# EAGLE schematic BEP32_Test_Interface5 (EAGLE 6.5.0)
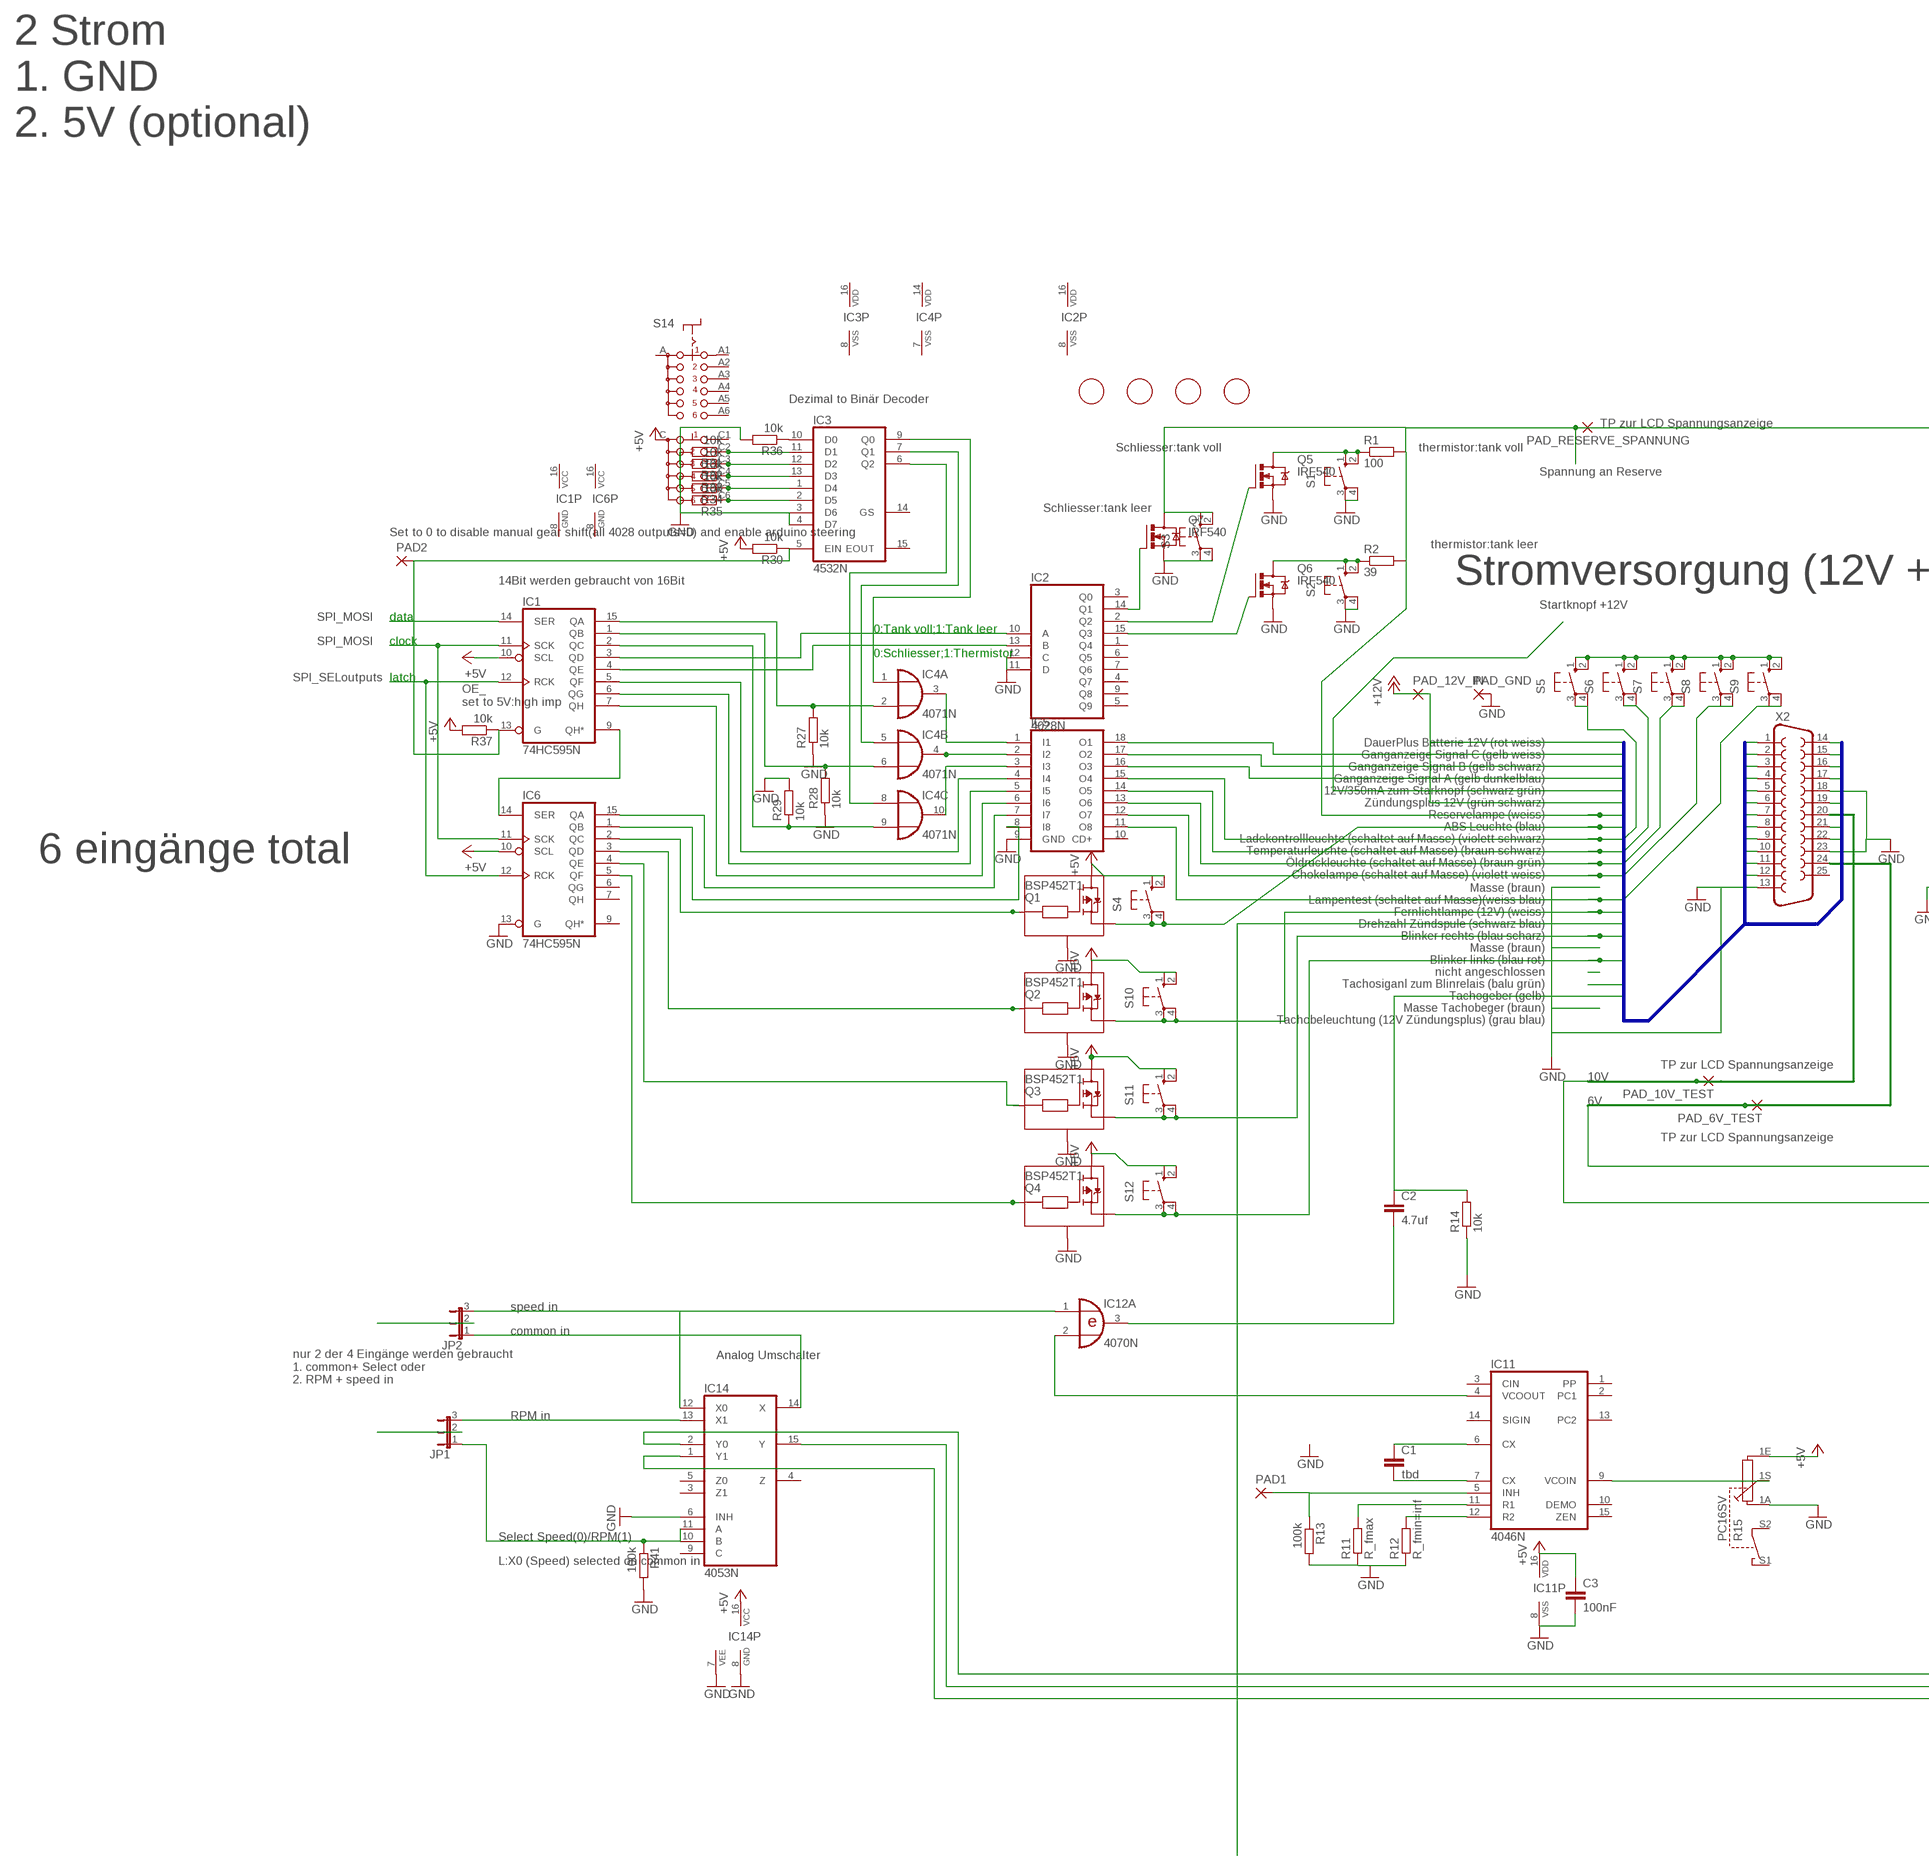
[diagram p0: schematic, sheet 1, part 1 of 2]
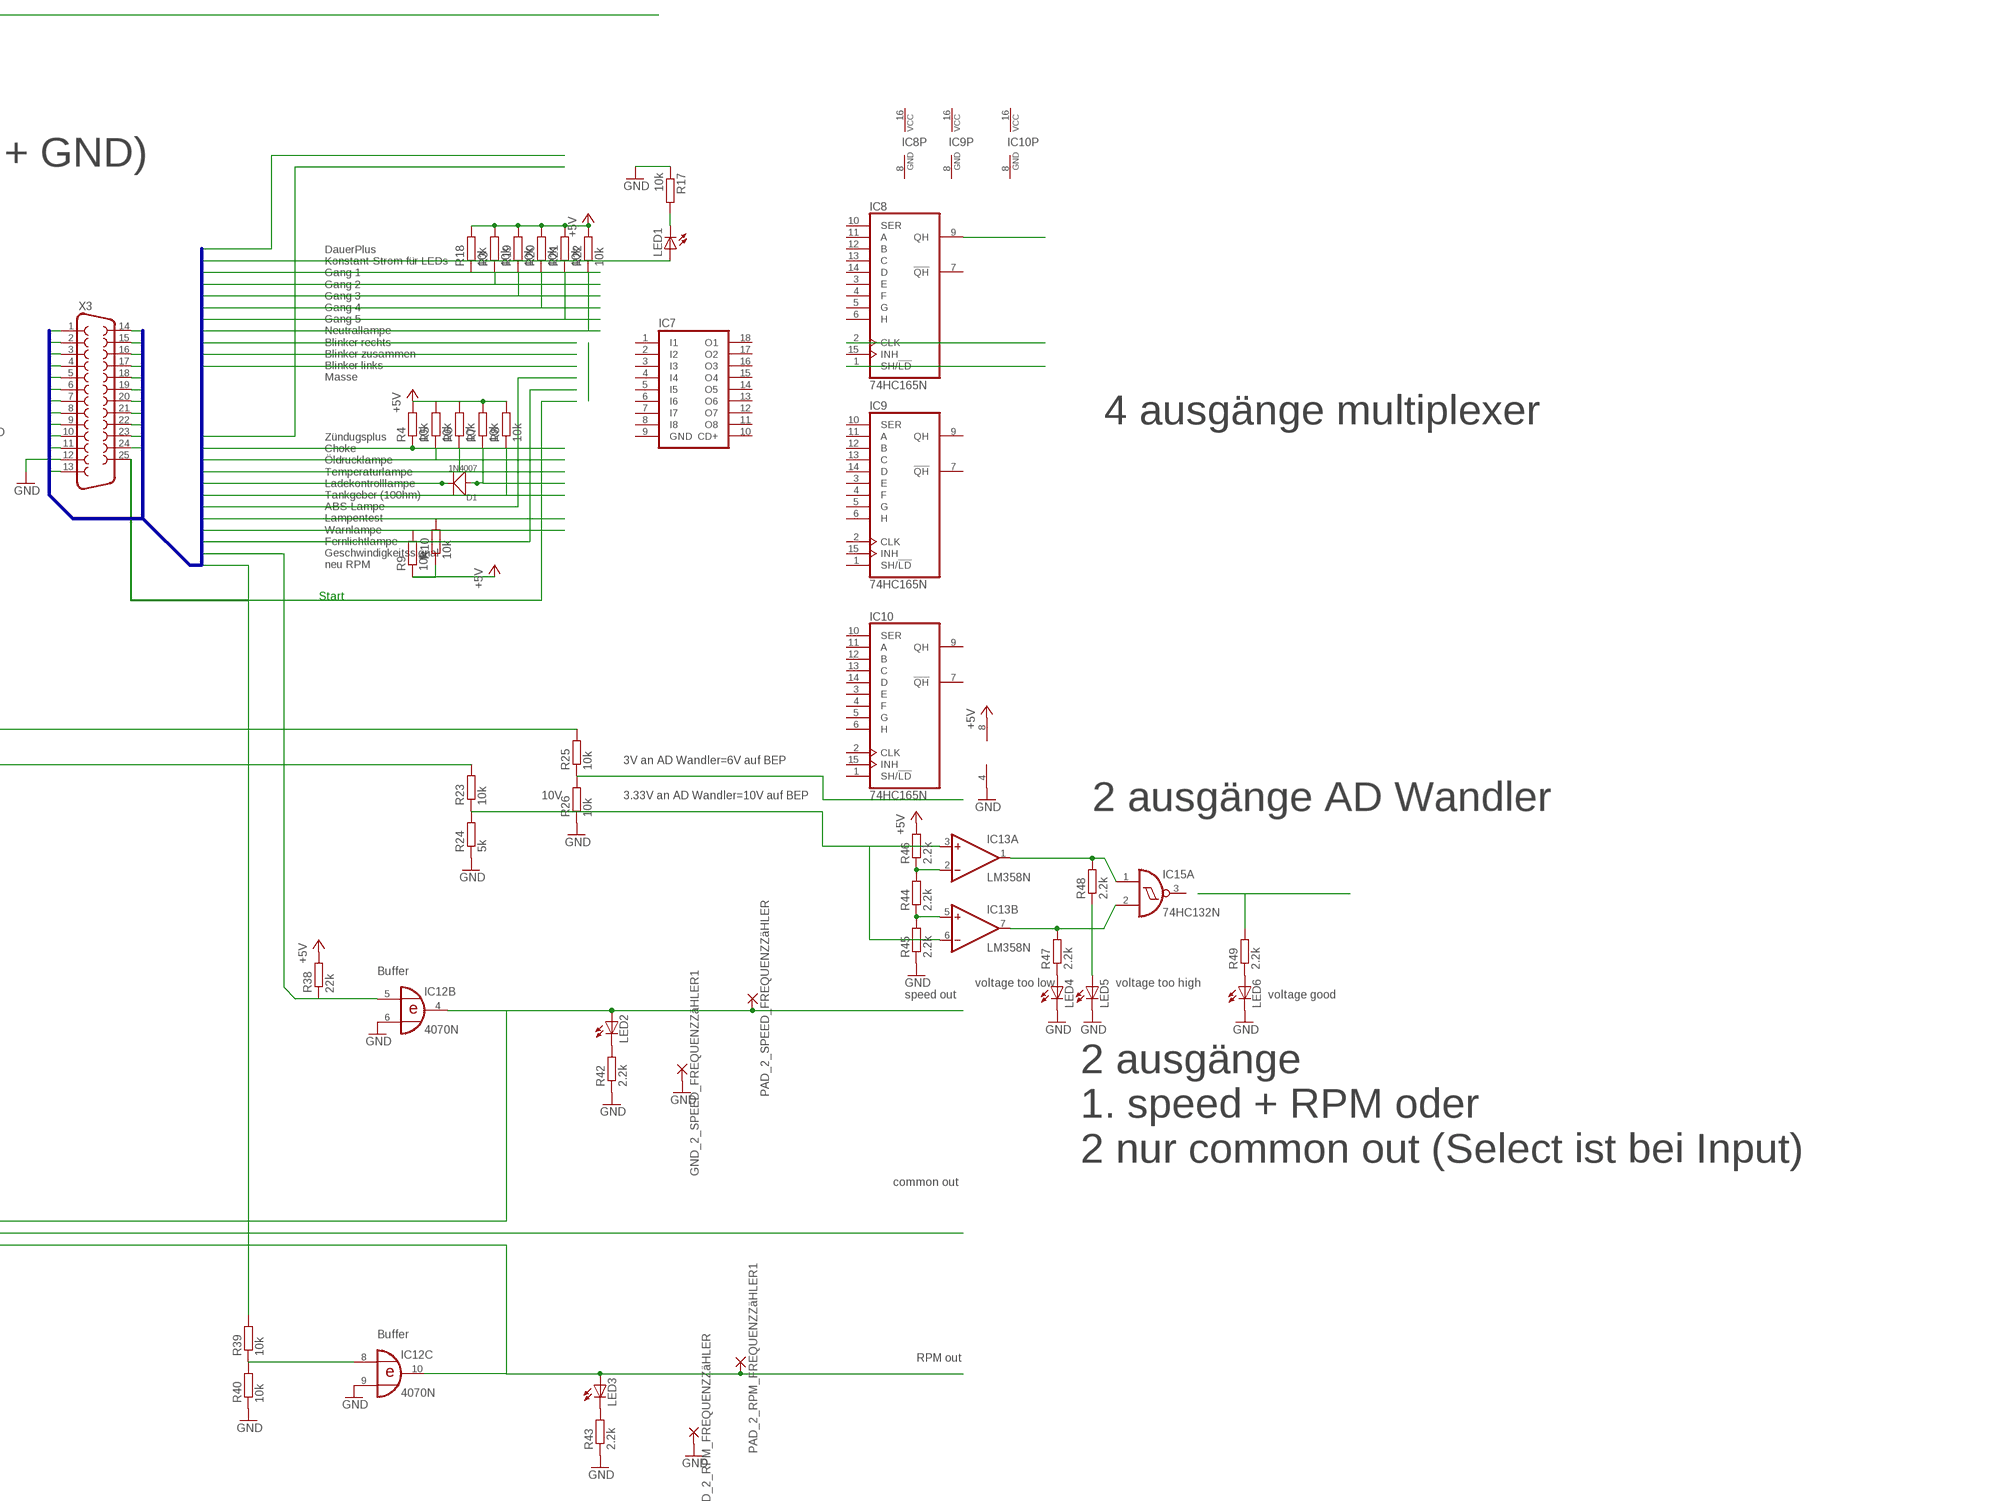
[diagram p1: schematic, sheet 1, part 2 of 2]

## Parts
C1  tbd  C-EUC1206K  [C1206K]
C2  4.7uf  C-EU025_050-025X075  [C025_050-025X075]
C3  100nF  C-EUC1206K  [C1206K]
D1  1N4007  DIODE-GEN-PURPOSE-1KV-1A(DO-214AC)  [DO-214AC]
GND_2_RPM_FREQUENZZäHLER  1,6/0,9  [1,6/0,9]
GND_2_SPEED_FREQUENZZäHLER1  1,6/0,9  [1,6/0,9]
IC1  74HC595N  [DIL16]
IC2  4028N  [DIL16]
IC3  4532N  [DIL16]
IC4  4071N  [DIL14]
IC5  ULN2803A  [DIL18]
IC6  74HC595N  [DIL16]
IC7  ULN2803A  [DIL18]
IC8  74HC165N  [DIL16]
IC9  74HC165N  [DIL16]
IC10  74HC165N  [DIL16]
IC11  4046N  [DIL16]
IC12  4070N  [DIL14]
IC13  LM358N  [DIL08]
IC14  4053N  [DIL16]
IC15  74HC132N  [DIL14]
JP1  JP2E  [JP2]
JP2  JP2E  [JP2]
LED1  LED5MM  [LED5MM]
LED2  LED5MM  [LED5MM]
LED3  LED5MM  [LED5MM]
LED4  LED5MM  [LED5MM]
LED5  LED5MM  [LED5MM]
LED6  LED5MM  [LED5MM]
PAD1  1,6/0,9  [1,6/0,9]
PAD2  1,6/0,9  [1,6/0,9]
PAD_2_RPM_FREQUENZZäHLER1  1,6/0,9  [1,6/0,9]
PAD_2_SPEED_FREQUENZZäHLER  1,6/0,9  [1,6/0,9]
PAD_6V_TEST  1,6/0,9  [1,6/0,9]
PAD_10V_TEST  1,6/0,9  [1,6/0,9]
PAD_12V_IN  1,6/0,9  [1,6/0,9]
PAD_GND  1,6/0,9  [1,6/0,9]
PAD_RESERVE_SPANNUNG  1,6/0,9  [1,6/0,9]
Q1  BSP452T1  [SOT223]
Q2  BSP452T1  [SOT223]
Q3  BSP452T1  [SOT223]
Q4  BSP452T1  [SOT223]
Q5  IRF540  [TO220BV]
Q6  IRF540  [TO220BV]
Q7  IRF540  [TO220BV]
R1  100  R-EU_0207/10  [0207/10]
R2  39  R-EU_0207/10  [0207/10]
R3  10k  R-EU_0207/10  [0207/10]
R4  10k  R-EU_0207/10  [0207/10]
R5  10k  R-EU_0207/10  [0207/10]
R6  10k  R-EU_0207/10  [0207/10]
R7  10k  R-EU_0207/10  [0207/10]
R8  10k  R-EU_0207/10  [0207/10]
R9  10k  R-EU_0207/10  [0207/10]
R10  10k  R-EU_0207/10  [0207/10]
R11  R_fmax  R-EU_0207/10  [0207/10]
R12  R_fmin=inf  R-EU_0207/10  [0207/10]
R13  100k  R-EU_0207/10  [0207/10]
R14  10k  R-EU_0207/10  [0207/10]
R15  PC16SV  [PC16SV]
R17  10k  R-EU_0207/10  [0207/10]
R18  10k  R-EU_0207/10  [0207/10]
R19  10k  R-EU_0207/10  [0207/10]
R20  10k  R-EU_0207/10  [0207/10]
R21  10k  R-EU_0207/10  [0207/10]
R22  10k  R-EU_0207/10  [0207/10]
R23  10k  R-EU_0207/10  [0207/10]
R24  5k  R-EU_0207/10  [0207/10]
R25  10k  R-EU_0207/10  [0207/10]
R26  10k  R-EU_0207/10  [0207/10]
R27  10k  R-EU_0207/10  [0207/10]
R28  10k  R-EU_0207/10  [0207/10]
R29  10k  R-EU_0207/10  [0207/10]
R30  10k  R-EU_0207/10  [0207/10]
R31  10k  R-EU_0207/10  [0207/10]
R32  10k  R-EU_0207/10  [0207/10]
R33  10k  R-EU_0207/10  [0207/10]
R34  10k  R-EU_0207/10  [0207/10]
R35  10k  R-EU_0207/10  [0207/10]
R36  10k  R-EU_0207/10  [0207/10]
R37  10k  R-EU_0207/10  [0207/10]
R38  22k  R-EU_0207/10  [0207/10]
R39  10k  R-EU_0207/10  [0207/10]
R40  10k  R-EU_0207/10  [0207/10]
R41  100k  R-EU_0207/10  [0207/10]
R42  2.2k  R-EU_0207/10  [0207/10]
R43  2.2k  R-EU_0207/10  [0207/10]
R44  2.2k  R-EU_0207/10  [0207/10]
R45  2.2k  R-EU_0207/10  [0207/10]
R46  2.2k  R-EU_0207/10  [0207/10]
R47  2.2k  R-EU_0207/10  [0207/10]
R48  2.2k  R-EU_0207/10  [0207/10]
R49  2.2k  R-EU_0207/10  [0207/10]
S1  40-XX  [B3F-40XX]
S2  40-XX  [B3F-40XX]
S3  40-XX  [B3F-40XX]
S4  40-XX  [B3F-40XX]
S5  40-XX  [B3F-40XX]
S6  40-XX  [B3F-40XX]
S7  40-XX  [B3F-40XX]
S8  40-XX  [B3F-40XX]
S9  40-XX  [B3F-40XX]
S10  40-XX  [B3F-40XX]
S11  40-XX  [B3F-40XX]
S12  40-XX  [B3F-40XX]
S14  CK102X06  [CK102X06]
U$1  FIDUCIAL  [FIDUCIAL_1MM]
U$2  FIDUCIAL  [FIDUCIAL_1MM]
U$3  FIDUCIAL  [FIDUCIAL_1MM]
U$4  FIDUCIAL  [FIDUCIAL_1MM]
X2  F25H  [F25H]
X3  F25H  [F25H]

## Nets
+5V: C3.1 IC1.10(SCL) IC6.10(SCL) IC11.16(VDD) IC13.8(P:V+) IC14.16(VCC) Q1.4(V+) Q2.4(V+) Q3.4(V+) Q4.4(V+) R3.2 R4.2 R5.2 R6.2 R7.2 R8.2 R9.1 R10.1 R15.1E R18.2 R19.2 R20.2 R21.2 R22.2 R30.2 R37.2 R38.2 R46.2 S4.2(S1) S10.2(S1) S11.2(S1) S12.2(S1) S14.C
BMW1: PAD_12V_IN.1(P) X2.1 ; supply symbol labelled +12V
BMW2: IC5.18(O1) X2.2
BMW3: IC5.17(O2) X2.3
BMW4: IC5.16(O3) X2.4
BMW5: X2.5
BMW6: X2.6
BMW7: PAD_RESERVE_SPANNUNG.1(P) Q7.D R1.2 R2.2 S3.1(S) S3.2(S1) X2.7
BMW8: Q1.1(OUT) S4.3(P) S4.4(P1) X2.8
BMW9: IC5.15(O4) S5.3(P) S5.4(P1) X2.9
BMW10: IC5.14(O5) S6.3(P) S6.4(P1) X2.10
BMW11: IC5.13(O6) S7.3(P) S7.4(P1) X2.11
BMW12: IC5.12(O7) S8.3(P) S8.4(P1) X2.12
BMW14: IC5.11(O8) S9.3(P) S9.4(P1) X2.14
BMW15: Q2.1(OUT) S10.3(P) S10.4(P1) X2.15
BMW16: X2.16
BMW17: Q3.1(OUT) S11.3(P) S11.4(P1) X2.17
BMW19: Q4.1(OUT) S12.3(P) S12.4(P1) X2.19
BMW21: X2.21
BMW22: C2.1 R14.2 X2.22
BMW24: PAD_10V_TEST.1(P) R23.2 X2.20
GND: C3.2 GND_2_RPM_FREQUENZZäHLER.1(P) GND_2_SPEED_FREQUENZZäHLER1.1(P) IC2.11(D) IC2.12(C) IC3.3(D6) IC3.4(D7) IC5.9(GND) IC6.13(G) IC11.8(VSS) IC12.6(B:I1) IC12.9(C:I1) IC13.4(P:V-) IC14.6(INH) IC14.7(VEE) IC14.8(GND) LED4.K(C) LED5.K(C) LED6.K(C) PAD_GND.1(P) Q1.2(GND) Q2.2(GND) Q3.2(GND) Q4.2(GND) Q5.S Q6.S Q7.S R11.1 R12.1 R13.2 R14.1 R15.1A R17.1 R24.1 R26.1 R27.1 R28.1 R29.2 R31.2 R32.2 R33.2 R34.2 R35.2 R36.2 R40.1 R41.2 R42.1 R43.1 R45.1 S1.3(P) S1.4(P1) S2.3(P) S2.4(P1) S3.3(P) S3.4(P1) X2.13 X2.18 X2.23 X3.12
N$2: Q6.D R2.1 S2.1(S) S2.2(S1)
N$3: Q5.D R1.1 S1.1(S) S1.2(S1)
N$4: IC2.2(Q2) Q5.G
N$5: Q6.G
N$6: IC2.14(Q1) Q7.G
N$7: IC4.3(A:O) IC5.1(I1)
N$8: IC4.4(B:O) IC5.2(I2)
N$9: IC4.10(C:O) IC5.3(I3)
N$10: IC1.15(QA) IC4.2(A:I1) R27.2
N$11: IC1.1(QB) IC4.6(B:I1) R28.2
N$12: IC1.2(QC) IC4.9(C:I1) R29.1
N$13: IC3.9(Q0) IC4.1(A:I0)
N$14: IC3.7(Q1) IC4.5(B:I0)
N$15: IC3.6(Q2) IC4.8(C:I0)
N$16: IC1.3(QD) IC2.10(A)
N$17: IC1.4(QE) IC2.13(B)
N$18: IC1.9(QH*) IC6.14(SER)
N$19: IC1.14(SER)
N$20: IC1.11(SCK) IC6.11(SCK)
N$21: IC1.12(RCK) IC6.12(RCK)
N$22: S5.1(S) S5.2(S1) S6.1(S) S6.2(S1) S7.1(S) S7.2(S1) S8.1(S) S8.2(S1) S9.1(S) S9.2(S1)
N$23: IC8.9(QH)
N$24: X3.25
N$27: IC1.5(QF) IC5.4(I4)
N$28: IC1.6(QG) IC5.5(I5)
N$29: IC1.7(QH) IC5.6(I6)
N$30: IC5.7(I7) IC6.15(QA)
N$31: IC5.8(I8) IC6.1(QB)
N$32: IC6.2(QC) Q1.3(IN)
N$33: IC6.3(QD) Q2.3(IN)
N$34: IC6.4(QE)
N$35: IC6.5(QF) Q4.3(IN)
N$36: IC8.2(CLK)
N$37: IC8.1(SH/!LD)
N$38: C1.2 IC11.7(CX)
N$39: C1.1 IC11.6(CX)
N$40: IC11.11(R1) R11.2
N$41: IC11.12(R2) R12.2
N$42: C2.2 IC12.3(A:O)
N$43: IC11.4(VCOOUT) IC12.2(A:I1)
N$44: IC11.5(INH) PAD1.1(P) R13.1
N$45: IC11.9(VCOIN) R15.1S
N$46: IC12.1(A:I0) IC14.12(X0) JP2.3
N$47: D1.1(+) R7.1
N$48: LED1.K(C) R17.2
N$50: R25.1 R26.2
N$51: IC14.14(X) JP2.1
N$52: IC1.13(G) IC3.5(EIN) PAD2.1(P) R30.1 R37.1
N$53: IC3.11(D1) R31.1 S14.C2
N$54: IC3.12(D2) R32.1 S14.C3
N$55: IC3.13(D3) R33.1 S14.C4
N$56: IC3.1(D4) R34.1 S14.C5
N$57: IC3.2(D5) R35.1 S14.C6
N$58: IC3.10(D0) R36.1
N$59: IC14.10(B) IC14.11(A) JP1.1 R41.1
N$60: IC14.15(Y)
N$61: LED2.K(C) R42.2
N$62: IC14.13(X1) JP1.3
N$63: IC12.8(C:I0) R39.1 R40.2
N$64: IC12.4(B:O) IC14.2(Y0) LED2.A PAD_2_SPEED_FREQUENZZäHLER.1(P)
N$65: IC12.10(C:O) IC14.1(Y1) LED3.A PAD_2_RPM_FREQUENZZäHLER1.1(P)
N$66: LED3.K(C) R43.2
N$67: IC13.5(B:+IN) R44.1 R45.2
N$68: JP1.2
N$69: JP2.2
N$70: IC13.2(A:-IN) R44.2 R46.1
N$71: IC13.3(A:+IN) IC13.6(B:-IN) R23.1 R24.2
N$73: IC13.1(A:OUT) IC15.1(A:I0) R48.2
N$74: IC13.7(B:OUT) IC15.2(A:I1) R47.2
N$75: LED4.A R47.1
N$76: LED5.A R48.1
N$77: LED6.A R49.1
N$78: R49.2
N$100: PAD_6V_TEST.1(P) R25.2 X2.24
WAGO1: X3.1
WAGO2: LED1.A X3.2
WAGO3: R18.1 X3.3
WAGO4: R3.1 X3.4
WAGO5: R19.1 X3.5
WAGO6: R20.1 X3.6
WAGO7: R21.1 X3.7
WAGO8: R22.1 X3.8
WAGO9: X3.9
WAGO10: X3.10
WAGO11: X3.11
WAGO13: X3.13
WAGO14: R4.1 X3.14
WAGO15: R5.1 X3.15
WAGO16: R6.1 X3.16
WAGO17: D1.2(-) X3.17
WAGO18: R8.1 X3.18
WAGO19: X3.19
WAGO20: R10.2 X3.20
WAGO21: R9.2 X3.21
WAGO22: X3.22
WAGO23: IC12.5(B:I0) R38.1 X3.23
WAGO24: R39.2 X3.24
Unconnected: IC2.1(Q4) IC2.3(Q0) IC2.4(Q7) IC2.5(Q9) IC2.6(Q5) IC2.7(Q6) IC2.9(Q8) IC2.15(Q3) IC3.14(GS) IC3.15(EOUT) IC4.11(D:O) IC4.12(D:I0) IC4.13(D:I1) IC5.10(CD+) IC6.6(QG) IC6.7(QH) IC6.9(QH*) IC7.1(I1) IC7.2(I2) IC7.3(I3) IC7.4(I4) IC7.5(I5) IC7.6(I6) IC7.7(I7) IC7.8(I8) IC7.10(CD+) IC7.11(O8) IC7.12(O7) IC7.13(O6) IC7.14(O5) IC7.15(O4) IC7.16(O3) IC7.17(O2) IC7.18(O1) IC8.3(E) IC8.4(F) IC8.5(G) IC8.6(H) IC8.7(!QH) IC8.10(SER) IC8.11(A) IC8.12(B) IC8.13(C) IC8.14(D) IC8.15(INH) IC9.1(SH/!LD) IC9.2(CLK) IC9.3(E) IC9.4(F) IC9.5(G) IC9.6(H) IC9.7(!QH) IC9.9(QH) IC9.10(SER) IC9.11(A) IC9.12(B) IC9.13(C) IC9.14(D) IC9.15(INH) IC10.1(SH/!LD) IC10.2(CLK) IC10.3(E) IC10.4(F) IC10.5(G) IC10.6(H) IC10.7(!QH) IC10.9(QH) IC10.10(SER) IC10.11(A) IC10.12(B) IC10.13(C) IC10.14(D) IC10.15(INH) IC11.1(PP) IC11.2(PC1) IC11.3(CIN) IC11.10(DEMO) IC11.13(PC2) IC11.14(SIGIN) IC11.15(ZEN) IC12.11(D:O) IC12.12(D:I0) IC12.13(D:I1) IC14.3(Z1) IC14.4(Z) IC14.5(Z0) IC14.9(C) IC15.3(A:O) IC15.4(B:I0) IC15.5(B:I1) IC15.6(B:O) IC15.8(C:O) IC15.9(C:I0) IC15.10(C:I1) IC15.11(D:O) IC15.12(D:I0) IC15.13(D:I1) Q3.3(IN) R15.S1 R15.S2 S4.1(S) S10.1(S) S11.1(S) S12.1(S) S14.A S14.A1 S14.A2 S14.A3 S14.A4 S14.A5 S14.A6 S14.C1 X2.25

## Buses
BMW[1..24]
WAGO[1..24]

## Notes on the sheet
- 2 Strom 
  1. GND
  2. 5V (optional)
- Dezimal to Binär Decoder
- TP zur LCD Spannungsanzeige
- Schliesser:tank voll | thermistor:tank voll
- Spannung an Reserve
- Schliesser:tank leer
- Set to 0 to disable manual gear shift(all 4028 outputs=0) and enable arduino steering
- thermistor:tank leer
- 14Bit werden gebraucht von 16Bit | Stromversorgung (12V + GND)
- Startknopf +12V
- SPI_MOSI | data
- 0:Tank voll;1:Tank leer
- SPI_MOSI | clock
- 0:Schliesser;1:Thermistor
- SPI_SELoutputs | latch
- OE_
  set to 5V:high imp
- DauerPlus
  Konstant-Strom für LEDs
  Gang 1
  Gang 2
  Gang 3
  Gang 4
  Gang 5
  Neutrallampe
  Blinker rechts
  Blinker zusammen
  Blinker links
  Masse
- DauerPlus Batterie 12V (rot weiss)
  Ganganzeige Signal C (gelb weiss)
  Ganganzeige Signal B (gelb schwarz)
  Ganganzeige Signal A (gelb dunkelblau)
  12V/350mA zum Starknopf (schwarz grün)
  Zündungsplus 12V (grün schwarz)
  Reservelampe (weiss)
  ABS Leuchte (blau)
  Ladekontrollleuchte (schaltet auf Masse) (violett schwarz)
  Temperaturleuchte (schaltet auf Masse) (braun schwarz)
  Öldruckleuchte (schaltet auf Masse) (braun grün)
  Chokelampe (schaltet auf Masse) (violett weiss)
- 6 eingänge total | 4 ausgänge multiplexer
- Zündugsplus
  Choke
  Öldrucklampe
  Temperaturlampe
  Ladekontrolllampe
  Tankgeber (100hm)
  ABS-Lampe
  Lampentest
  Warnlampe
  Fernlichtlampe
  Geschwindigkeitssignal
  neu RPM
- Masse (braun)
  Lampentest (schaltet auf Masse)(weiss blau)
  Fernlichtlampe (12V) (weiss)
  Drehzahl Zündspule (schwarz blau)
  Blinker rechts (blau scharz)
  Masse (braun)
  Blinker links (blau rot)
  nicht angeschlossen
  Tachosiganl zum Blinrelais (balu grün)
  Tachogeber (gelb)
  Masse Tachobeger (braun)
  Tachobeleuchtung (12V Zündungsplus) (grau blau)
- Start
- TP zur LCD Spannungsanzeige
- 10V
- 6V
- TP zur LCD Spannungsanzeige
- 3V an AD Wandler=6V auf BEP
- 10V | 3.33V an AD Wandler=10V auf BEP
- 2 ausgänge AD Wandler
- speed in
- common in
- Analog Umschalter
- nur 2 der 4 Eingänge werden gebraucht
  1. common+ Select oder
  2. RPM + speed in
- RPM in | Buffer
- voltage too low | voltage too high
- speed out | voltage good
- Select Speed(0)/RPM(1)
- L:X0 (Speed) selected on common in
- 2 ausgänge
  1. speed + RPM oder
  2 nur common out (Select ist bei Input)
- common out
- Buffer
- RPM out

## Power pins joined to a net without a drawn wire
GND: IC1.8(GND) IC6.8(GND) IC7.9(GND) IC8.8(GND) IC9.8(GND) IC10.8(GND) IC15.7(P:GND)
VCC: IC1.16(VCC) IC6.16(VCC) IC8.16(VCC) IC9.16(VCC) IC10.16(VCC) IC15.14(P:VCC)
VDD: IC2.16(VDD) IC3.16(VDD) IC4.14(P:VDD) IC12.14(P:VDD)
VSS: IC2.8(VSS) IC3.8(VSS) IC4.7(P:VSS) IC12.7(P:VSS)

## Library data of the parts
C1-C3 = rcl:C-EU: CAPACITOR, European symbol
D1 = Diode-do214ac:DIODE-GEN-PURPOSE-1KV-1A(DO-214AC): 304010013; MPN: 1N4007
GND_2_RPM_FREQUENZZäHLER GND_2_SPEED_FREQUENZZäHLER1 PAD1 PAD2 PAD_2_RPM_FREQUENZZäHLER1 PAD_2_SPEED_FREQUENZZäHLER PAD_6V_TEST PAD_10V_TEST PAD_12V_IN PAD_GND PAD_RESERVE_SPANNUNG = wirepad:1,6/0,9: THROUGH-HOLE PAD
IC1 IC6 = 74xx-eu:74*595: 8-bit SHIFT REGISTER, output latch
IC2 = 40xx:4028: BCD to decimal DECODER
IC3 = 45xx:4532: 8-bit PRIORITY ENCODER
IC4 = 40xx:4071: Quad 2-input OR
IC5 IC7 = uln-udn:ULN2803A: DRIVER ARRAY
IC8-IC10 = 74xx-eu:74*165: 8-bit parallel load SHIFT REGISTER
IC11 = 40xx:4046: Micropower PLL
IC12 = 40xx:4070: Quad 2-input XOR
IC13 = linear:LM358: OP AMP also LM158; LM258; LM2904 Source: http://cache.national.com/ds/LM/LM158.pdf
IC14 = 40xx:4053: Triple 2-channel ANALOG MULTIPLEXER
IC15 = 74xx-eu:74*132: Quad 2-input NAND schmitt trigger
JP1 JP2 = jumper:JP2E: JUMPER
LED1-LED6 = led:LED: LED OSRAM: - CHIPLED LG R971, LG N971, LY N971, LG Q971, LY Q971, LO R971, LY R971 LH N974, LH R974 LS Q976, LO Q976, LY Q976 LO Q996 - Hyper CHIPLED LW Q18S LB Q993, LB Q99A, LB R99A - SideLED LS A670, LO A670, LY A670, LG A670, LP A670 LB A673, LV A673, LT A673, LW A673 LH A674 LY A675 LS A676, LA A676, LO A676, LY A676, LW A676 LS A679, LY A679, LG A679 - Hyper Micro SIDELED® LS Y876, LA Y876, LO Y876, LY Y876 LT Y87S - SmartLED LW L88C, LW L88S LB L89C, LB L89S, LG L890 LS L89K, LO L89K, LY L89K LS L896, LA L896, LO L896, LY L896 - TOPLED LS T670, LO T670, LY T670, LG T670, LP T670 LSG T670, LSP T670, LSY T670, LOP T670, LYG T670 LG T671, LOG T671, LSG T671 LB T673, LV T673, LT T673, LW T673 LH T674 LS T676, LA T676, LO T676, LY T676, LB T676, LH T676, LSB T676, LW T676 LB T67C, LV T67C, LT T67C, LS T67K, LO T67K, LY T67K, LW E67C LS E67B, LA E67B, LO E67B, LY E67B, LB E67C, LV E67C, LT E67C LW T67C LS T679, LY T679, LG T679 LS T770, LO T770, LY T770, LG T770, LP T770 LB T773, LV T773, LT T773, LW T773 LH T774 LS E675, LA E675, LY E675, LS T675 LS T776, LA T776, LO T776, LY T776, LB T776 LHGB T686 LT T68C, LB T68C - Hyper Mini TOPLED® LB M676 - Mini TOPLED Santana® LG M470 LS M47K, LO M47K, LY M47K Source: http://www.osram.convergy.de LUXEON: - LUMILED® LXK2-PW12-R00, LXK2-PW12-S00, LXK2-PW14-U00, LXK2-PW14-V00 LXK2-PM12-R00, LXK2-PM12-S00, LXK2-PM14-U00 LXK2-PE12-Q00, LXK2-PE12-R00, LXK2-PE12-S00, LXK2-PE14-T00, LXK2-PE14-U00 LXK2-PB12-K00, LXK2-PB12-L00, LXK2-PB12-M00, LXK2-PB14-N00, LXK2-PB14-P00, LXK2-PB14-Q00 LXK2-PR12-L00, LXK2-PR12-M00, LXK2-PR14-Q00, LXK2-PR14-R00 LXK2-PD12-Q00, LXK2-PD12-R00, LXK2-PD12-S00 LXK2-PH12-R00, LXK2-PH12-S00 LXK2-PL12-P00, LXK2-PL12-Q00, LXK2-PL12-R00 Source: www.luxeon.com KINGBRIGHT: KA-3528ASYC Source: www.kingbright.com
Q1-Q4 = BSP452:BSP452
Q5-Q7 = transistor-power:IRF540: HEXFET Power MOSFET
R1-R14 R17-R49 = rcl:R-EU_: RESISTOR, European symbol
R15 = piher:PC16SV: POTENTIOMETER vertical single carbon potentiometer with switch, 16 mm; OC_FARNELL: unknown; OC_NEWARK: unknown
S1-S12 = switch-omron:40-XX: OMRON SWITCH; MF: OMRON COMPONENTS USA; MPN: B3F-4000; OC_FARNELL: 176434; OC_NEWARK: 36K3105
S14 = switch:CK102X06: ROTARY SWITCH C&K
U$1-U$4 = Fiducial:FIDUCIAL: For use by pick and place machines to calibrate the vision/machine, 1mm By microbuilder.eu
X2 X3 = con-subd:F25: SUB-D; OC_FARNELL: unknown; OC_NEWARK: unknown